# EAGLE design drive-sys-board (EAGLE 7.6.0)
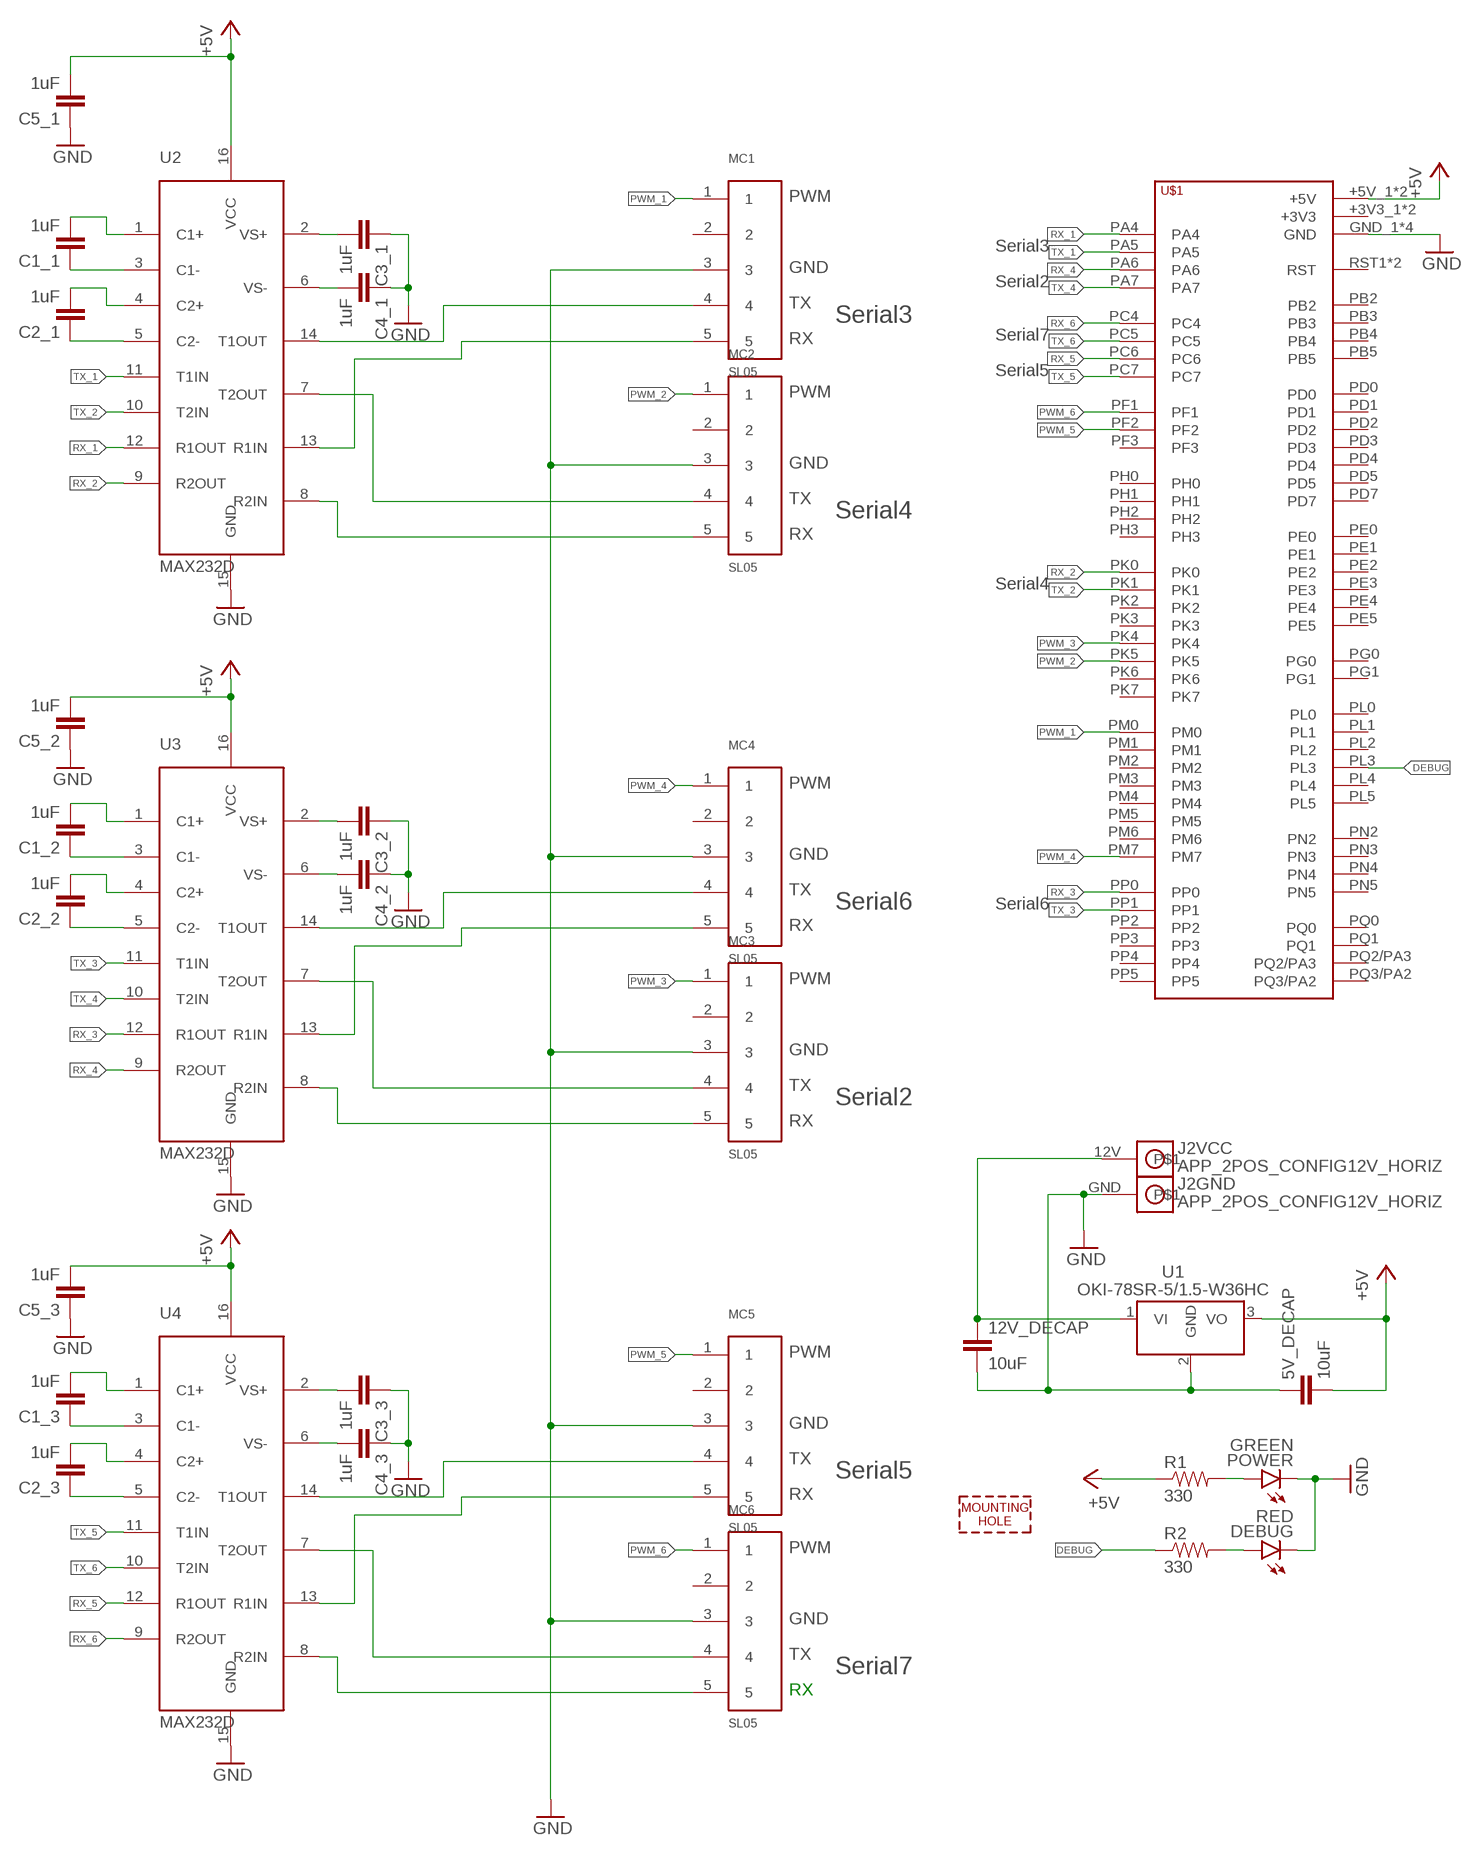
[diagram p0: schematic, sheet 1]

## Parts
5V_DECAP  10uF  CAP0805  [0805]
12V_DECAP  10uF  CAP0805  [0805]
C1_1  1uF  CAP0805  [0805]
C1_2  1uF  CAP0805  [0805]
C1_3  1uF  CAP0805  [0805]
C2_1  1uF  CAP0805  [0805]
C2_2  1uF  CAP0805  [0805]
C2_3  1uF  CAP0805  [0805]
C3_1  1uF  CAP0805  [0805]
C3_2  1uF  CAP0805  [0805]
C3_3  1uF  CAP0805  [0805]
C4_1  1uF  CAP0805  [0805]
C4_2  1uF  CAP0805  [0805]
C4_3  1uF  CAP0805  [0805]
C5_1  1uF  CAP0805  [0805]
C5_2  1uF  CAP0805  [0805]
C5_3  1uF  CAP0805  [0805]
DEBUG  RED  LED-RED1206  [LED-1206]
H2  MOUNTING_HOLE#6  [#6_SCREW]
J2  APP_2POS_CONFIG12V_HORIZ  [APP45_12V_HORIZ_CONFIG]
MC1  SL05  [MOLEX_SL_05_TH]
MC2  SL05  [MOLEX_SL_05_TH]
MC3  SL05  [MOLEX_SL_05_TH]
MC4  SL05  [MOLEX_SL_05_TH]
MC5  SL05  [MOLEX_SL_05_TH]
MC6  SL05  [MOLEX_SL_05_TH]
POWER  GREEN  LED-GREEN1206  [LED-1206]
R1  330  0.22OHM-1/4W-1%(0805)  [0805]
R2  330  0.22OHM-1/4W-1%(0805)  [0805]
U1  OKI-78SR-5/1.5-W36HC  [OKI-78SR_HORIZ]
U2  MAX232D  [SOIC16]
U3  MAX232D  [SOIC16]
U4  MAX232D  [SOIC16]
U$1  TIVA-1294  [TIVA-C-CONNECTED]

## Nets
+5V: 5V_DECAP.2 C5_1.2 C5_2.2 C5_3.2 R1.1 U1.3(VO) U2.16(VCC) U3.16(VCC) U4.16(VCC) U$1.+5V_1(+5V) U$1.+5V_2(+5V)
DEBUG: R2.1 U$1.PL3
GND: 5V_DECAP.1 12V_DECAP.2 C3_1.1 C3_2.1 C3_3.1 C4_1.1 C4_2.1 C4_3.1 C5_1.1 C5_2.1 C5_3.1 DEBUG.C J2.GND MC1.3 MC2.3 MC3.3 MC4.3 MC5.3 MC6.3 POWER.C U1.2(GND) U2.15(GND) U3.15(GND) U4.15(GND) U$1.GND_1(GND) U$1.GND_2(GND) U$1.GND_3(GND) U$1.GND_4(GND)
N$3: C1_1.2 U2.1(C1+)
N$4: C1_1.1 U2.3(C1-)
N$5: 12V_DECAP.1 J2.12V U1.1(VI)
N$6: C2_1.2 U2.4(C2+)
N$7: C2_1.1 U2.5(C2-)
N$8: C3_1.2 U2.2(VS+)
N$9: C4_1.2 U2.6(VS-)
N$10: DEBUG.A R2.2
N$11: C1_2.2 U3.1(C1+)
N$12: C1_2.1 U3.3(C1-)
N$13: C2_2.2 U3.4(C2+)
N$14: C3_2.2 U3.2(VS+)
N$15: C4_2.2 U3.6(VS-)
N$16: C2_2.1 U3.5(C2-)
N$17: POWER.A R1.2
N$18: C1_3.2 U4.1(C1+)
N$19: C1_3.1 U4.3(C1-)
N$20: C2_3.2 U4.4(C2+)
N$21: C3_3.2 U4.2(VS+)
N$22: C4_3.2 U4.6(VS-)
N$23: C2_3.1 U4.5(C2-)
N$26: MC5.4 U4.14(T1OUT)
N$27: MC6.5 U4.8(R2IN)
N$28: MC6.4 U4.7(T2OUT)
N$29: MC5.5 U4.13(R1IN)
N$30: MC3.5 U3.8(R2IN)
N$31: MC3.4 U3.7(T2OUT)
N$32: MC4.4 U3.14(T1OUT)
N$33: MC4.5 U3.13(R1IN)
N$34: MC2.5 U2.8(R2IN)
N$35: MC2.4 U2.7(T2OUT)
N$36: MC1.4 U2.14(T1OUT)
N$37: MC1.5 U2.13(R1IN)
PWM_1: MC1.1 U$1.PM0
PWM_2: MC2.1 U$1.PK5
PWM_3: MC3.1 U$1.PK4
PWM_4: MC4.1 U$1.PM7
PWM_5: MC5.1 U$1.PF2
PWM_6: MC6.1 U$1.PF1
RX_1: U2.12(R1OUT) U$1.PA4
RX_2: U2.9(R2OUT) U$1.PK0
RX_3: U3.12(R1OUT) U$1.PP0
RX_4: U3.9(R2OUT) U$1.PA6
RX_5: U4.12(R1OUT) U$1.PC6
RX_6: U4.9(R2OUT) U$1.PC4
TX_1: U2.11(T1IN) U$1.PA5
TX_2: U2.10(T2IN) U$1.PK1
TX_3: U3.11(T1IN) U$1.PP1
TX_4: U3.10(T2IN) U$1.PA7
TX_5: U4.11(T1IN) U$1.PC7
TX_6: U4.10(T2IN) U$1.PC5
Unconnected: MC1.2 MC2.2 MC3.2 MC4.2 MC5.2 MC6.2 U$1.+3V3_1(+3V3) U$1.+3V3_2(+3V3) U$1.PB2 U$1.PB3 U$1.PB4 U$1.PB5 U$1.PD0 U$1.PD1 U$1.PD2 U$1.PD3 U$1.PD4 U$1.PD5 U$1.PD7 U$1.PE0 U$1.PE1 U$1.PE2 U$1.PE3 U$1.PE4 U$1.PE5 U$1.PF3 U$1.PG0 U$1.PG1 U$1.PH0 U$1.PH1 U$1.PH2 U$1.PH3 U$1.PK2 U$1.PK3 U$1.PK6 U$1.PK7 U$1.PL0 U$1.PL1 U$1.PL2 U$1.PL4 U$1.PL5 U$1.PM1 U$1.PM2 U$1.PM3 U$1.PM4 U$1.PM5 U$1.PM6 U$1.PN2 U$1.PN3 U$1.PN4 U$1.PN5 U$1.PP2 U$1.PP3 U$1.PP4 U$1.PP5 U$1.PQ0 U$1.PQ1 U$1.PQ2/PA3 U$1.PQ3/PA2 U$1.RST1(RST) U$1.RST_2(RST)

## Notes on the sheet
- PWM
- Serial3
- GND
- Serial2
- TX
- Serial3
- RX | Serial7
- Serial5
- PWM
- GND
- TX
- Serial4
- RX
- Serial4
- PWM
- GND
- TX
- Serial6 | Serial6
- RX
- PWM
- GND
- TX
- Serial2
- RX
- PWM
- GND
- TX
- Serial5
- RX
- PWM
- GND
- TX
- Serial7
- RX

## Library data of the parts
5V_DECAP 12V_DECAP C1_1-C1_3 C2_1-C2_3 C3_1-C3_3 C4_1-C4_3 C5_1-C5_3 = SparkFun-Capacitors:CAP: Capacitor Standard 0603 ceramic capacitor, and 0.1" leaded capacitor.
DEBUG = SparkFun-LED:LED-RED: Assorted Red LEDs LilyPad 1206- DIO-09912 1206- DIO-00809 0603- DIO-00819 "SMART" means more efficient and expensive; PROD_ID: DIO-09912
H2 = MRDT-Hardware:MOUNTING_HOLE: Mounting hole for M6 bolt. Standard use mounting hole for: Tiva C Connected - M6 Anderson Powerpole Mounting Wing - M8 Most frame-mounted PCB's - M8
J2 = MRDT-Connectors:APP_2POS_CONFIG; COLOR1: YELLOW; COLOR2: BLACK
MC1-MC6 = MRDT-Connectors:SL05
POWER = SparkFun-LED:LED-GREEN: Various green LEDs Green LEDs used in SFE Production 0603- DIO-00821 LARGE- DIO-00862 LILYPAD- DIO-09910; PROD_ID: DIO-00862
R1 R2 = SparkFun-Resistors:0.22OHM-1/4W-1%(0805): RES-09883; PROD_ID: RES-09883; VALUE: 0.22
U1 = MRDT-ICs:OKI-78SR-*/1.5-W36?C: 4.95W DC/DC Converter Manufacturer: Murata; VOUT: +5v
U2-U4 = MRDT-ICs:MAX*232; OPERATING_VOLTAGE: 5V
U$1 = MRDT-Microcontrollers:TIVA-1294: TIVA C CONNECTED LAUNCHPAD

## Board
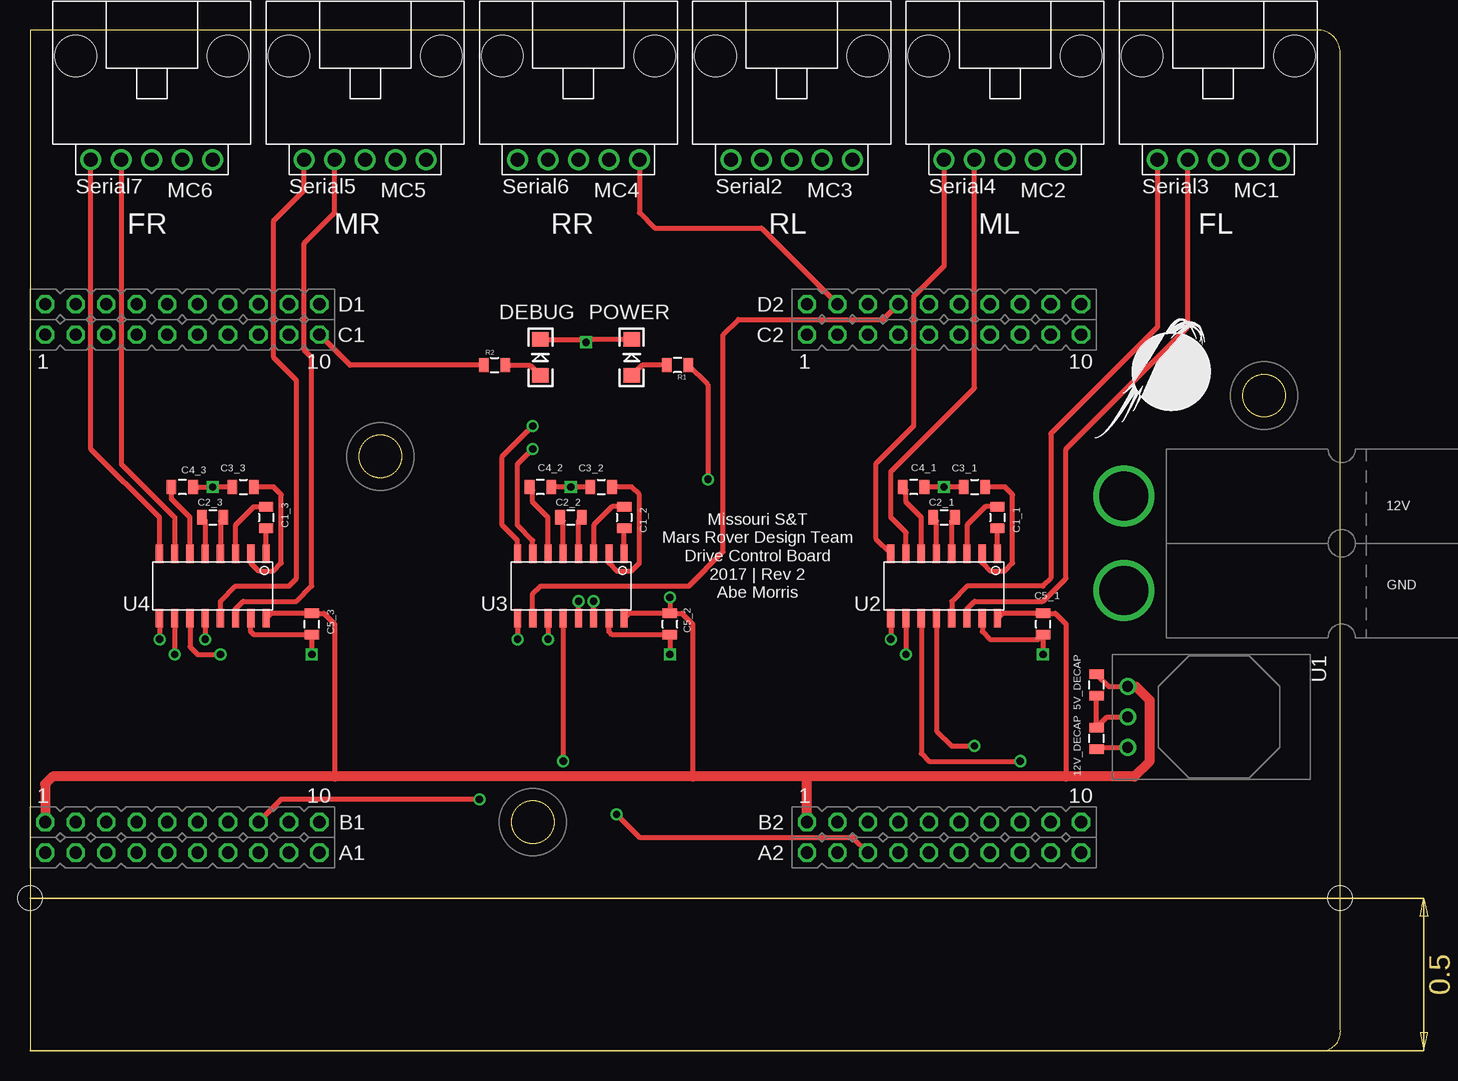
[diagram p1: board, top side]
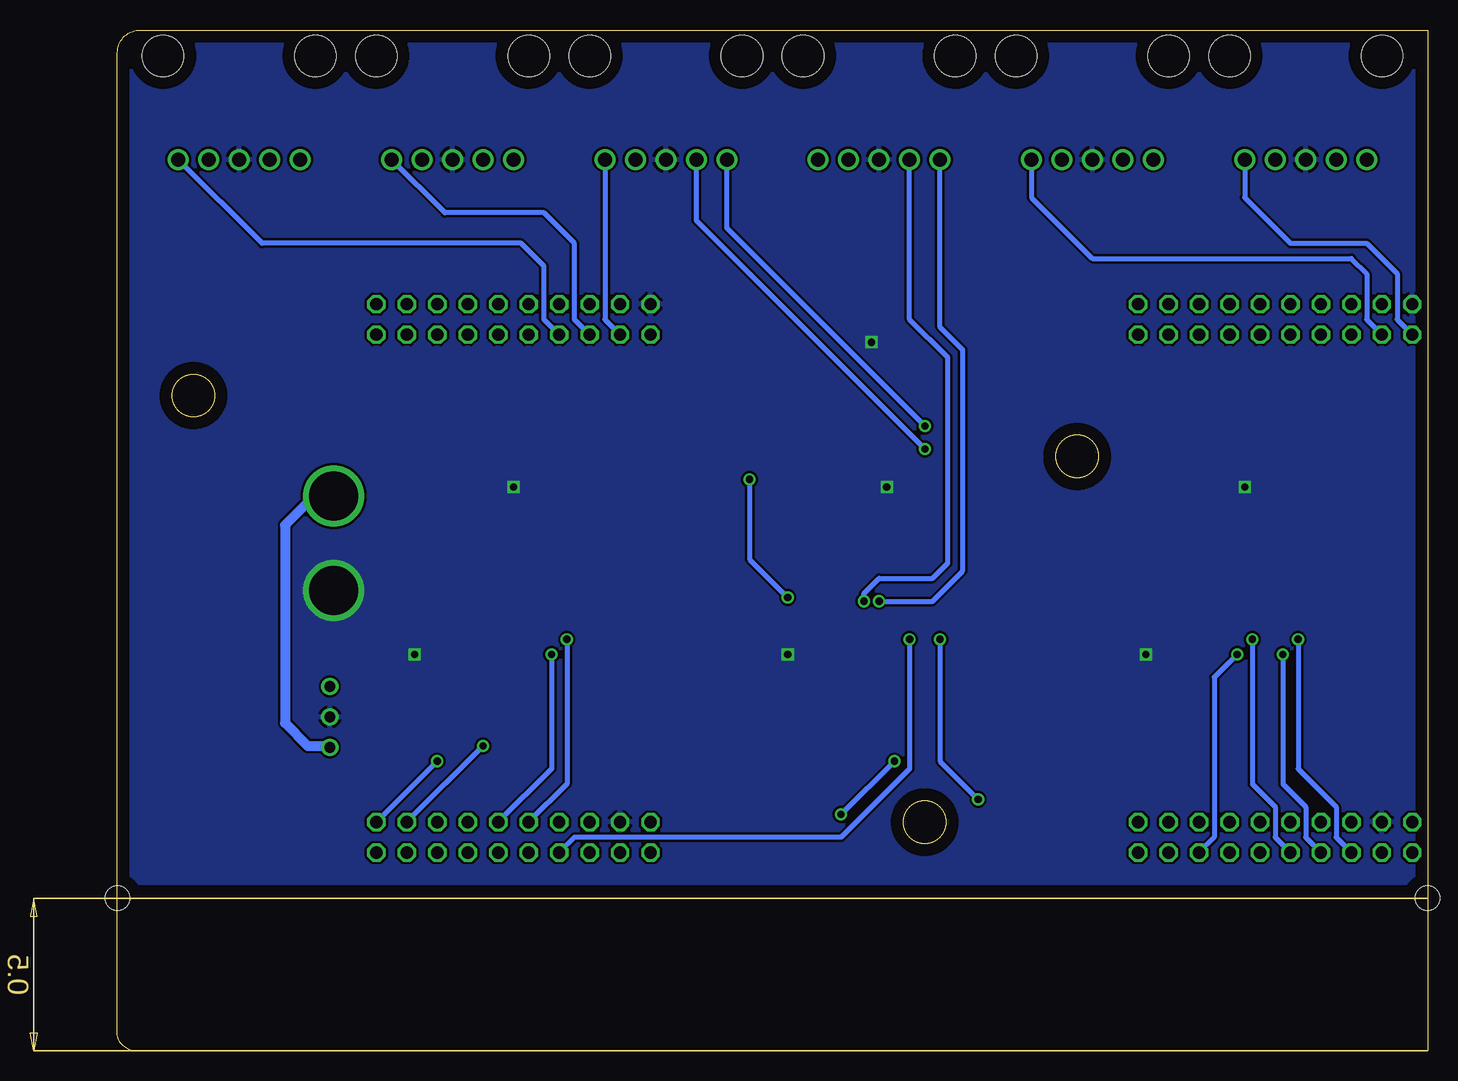
[diagram p2: board, bottom side, seen from below]

Size 109.25 x 85.09 mm. Coordinates in mm from the lower left corner, seen from the top.
Outline: 109.22,1.9 109.22,83.19 arc90 107.31,85.09 0,85.09 0,0 107.95,0 arc90 109.22,1.9
Copper layers (1*16): Top 0.035mm / dielectric 1.5mm / Bottom 0.035mm
Design rules "default *": minimum track width 10mil, minimum drill 15mil, track to track 8mil, track to pad 8mil, pad to pad 8mil, via to via 8mil, smd to smd 8mil, copper to edge 40mil, drill to drill 8mil, minimum pad ring 10mil, minimum via ring 8mil, stop-mask expansion 4mil, vias tented up to drill 0mil, thermal gap 10mil
Holes 2.03 mm at 0,12.7 109.22,12.7

### Footprints (pad centres in the part's own frame; a part is rotated, then mirrored left to right if it is on the bottom)
0805 = smd 0.8 x 1.2: 1 -0.9,0; 2 0.9,0
LED-1206 = smd 1.2 x 1.4: A -1.5,0; C 1.5,0
APP45_12V_HORIZ_CONFIG = drill 4.064: 12V 28.194,3.937; GND 28.194,11.811
MOLEX_SL_05_TH = drill 1.168: 1 5.08,0; 2 2.54,0; 3 0,0; 4 -2.54,0; 5 -5.08,0 | hole 3.454: -6.35,8.636; 6.35,8.636
OKI-78SR_HORIZ = drill 0.9 pad 1.422: 1 0,0; 2 -2.54,0; 3 -5.08,0
SOIC16 = smd 0.6 x 1.55: 1 -4.445,-2.7; 2 -3.175,-2.7; 3 -1.905,-2.7; 4 -0.635,-2.7; 5 0.635,-2.7; 6 1.905,-2.7; 7 3.175,-2.7; 8 4.445,-2.7; 9 4.445,2.7; 10 3.175,2.7; 11 1.905,2.7; 12 0.635,2.7; 13 -0.635,2.7; 14 -1.905,2.7; 15 -3.175,2.7; 16 -4.445,2.7
TIVA-C-CONNECTED = drill 1.016 octagon: +3V3_1 59.69,54.61; +3V3_2 123.19,54.61; +5V_1 59.69,52.07; +5V_2 123.19,52.07; GND_1 57.15,52.07; GND_2 59.69,8.89; GND_3 120.65,52.07; GND_4 123.19,8.89; PA4 39.37,52.07; PA5 36.83,52.07; PA6 105.41,52.07; PA7 52.07,8.89; PB2 102.87,54.61; PB3 100.33,54.61; PB4 54.61,52.07; PB5 52.07,52.07; PC4 118.11,54.61; PC5 115.57,54.61; PC6 113.03,54.61; PC7 105.41,54.61; PD0 107.95,8.89; PD1 110.49,8.89; PD2 57.15,54.61; PD3 107.95,54.61; PD4 49.53,54.61; PD5 46.99,54.61; PD7 107.95,52.07; PE0 118.11,52.07; PE1 115.57,52.07; PE2 113.03,52.07; PE3 110.49,52.07; PE4 120.65,54.61; PE5 110.49,54.61; PF1 123.19,11.43; PF2 120.65,11.43; PF3 118.11,11.43; PG0 115.57,11.43; PG1 59.69,11.43; PH0 44.45,11.43; PH1 41.91,11.43; PH2 118.11,8.89; PH3 115.57,8.89; PK0 49.53,52.07; PK1 46.99,52.07; PK2 44.45,52.07; PK3 41.91,52.07; PK4 57.15,11.43; PK5 54.61,11.43; PK6 39.37,11.43; PK7 36.83,11.43; PL0 107.95,11.43; PL1 105.41,11.43; PL2 102.87,11.43; PL3 100.33,11.43; PL4 113.03,11.43; PL5 110.49,11.43; PM0 52.07,11.43; PM1 49.53,11.43; PM2 46.99,11.43; PM3 120.65,8.89; PM4 102.87,52.07; PM5 100.33,52.07; PM6 36.83,8.89; PM7 57.15,8.89; PN2 105.41,8.89; PN3 102.87,8.89; PN4 36.83,54.61; PN5 39.37,54.61; PP0 54.61,54.61; PP1 52.07,54.61; PP2 100.33,8.89; PP3 41.91,8.89; PP4 41.91,54.61; PP5 54.61,8.89; PQ0 44.45,54.61; PQ1 39.37,8.89; PQ2/PA3 46.99,8.89; PQ3/PA2 44.45,8.89; RST1 49.53,8.89; RST_2 113.03,8.89

### Placement (x,y rotation side)
5V_DECAP  88.9,30.48 90 top
12V_DECAP  88.9,26.04 90 top
C1_1  80.64,44.45 270 top
C1_2  49.53,44.45 270 top
C1_3  19.69,44.45 270 top
C2_1  76.2,44.45 0 top
C2_2  45.08,44.45 0 top
C2_3  15.24,44.45 0 top
C3_1  78.74,46.99 0 top
C3_2  47.62,46.99 0 top
C3_3  17.78,46.99 0 top
C4_1  73.66,46.99 180 top
C4_2  42.54,46.99 180 top
C4_3  12.7,46.99 180 top
C5_1  84.45,35.56 90 top
C5_2  53.34,35.56 90 top
C5_3  23.49,35.56 90 top
DEBUG  42.54,57.79 90 top
H1  MOUNTING_HOLE#6  [#6_SCREW]  29.21,49.53 180 top
H2  41.91,19.05 180 top
H3  MOUNTING_HOLE#6  [#6_SCREW]  102.87,54.61 180 top
J2  119.38,50.16 180 top
MC1  99.06,74.3 0 top
MC2  81.28,74.3 0 top
MC3  63.5,74.3 0 top
MC4  45.72,74.3 0 top
MC5  27.94,74.3 0 top
MC6  10.16,74.3 0 top
POWER  50.16,57.79 90 top
R1  53.97,57.15 180 top
R2  38.73,57.15 0 top
U1  91.5,25.27 270 top
U2  76.2,38.73 180 top
U3  45.08,38.73 180 top
U4  15.24,38.73 180 top
U$1  124.46,71.12 180 top
U$2  [MRDT_LOGO]  98.44,61.89 180 top

### Tracks (layer width: path | path; a pad name or v marks a point on that pad's centre or on a via)
+5V  (via drill 0.6)
  Top 0.406: 86.36,22.86 86.36,35.56 85.46,36.46 C5_1.2 81.07,36.46 U2.16 | C5_2.2 54.34,36.46 55.24,35.56 55.24,22.86 | C5_2.2 49.95,36.46 U3.16 | 25.4,22.86 25.4,35.56 24.5,36.46 C5_3.2 20.11,36.46 U4.16 | v56.51,47.62 56.51,55.51 R1.1 | v53.34,37.78 C5_2.2 | 5V_DECAP.2 89.93,30.35 U1.3
  Top 0.813: 64.77,22.86 86.36,22.86 92.07,22.86 93.34,24.13 93.34,29.21 92.2,30.35 U1.3 | 64.77,22.86 55.24,22.86 25.4,22.86 1.91,22.86 1.27,22.23 U$1.+5V_2 | U$1.+5V_1 64.77,22.86
  Bottom 0.406: v56.51,47.62 56.51,40.96 v53.34,37.78
DEBUG
  Top 0.406: R2.1 26.67,57.15 U$1.PL3
GND  (via drill 0.6)
  Top 0.406: 5V_DECAP.1 12V_DECAP.2 89.78,27.81 U1.2 | U2.15 79.38,34.92 80.01,34.29 84.08,34.29 C5_1.1 v84.45,33.02 | v53.34,33.02 C5_2.1 48.52,34.66 48.26,34.92 U3.15 | v23.49,33.02 C5_3.1 18.68,34.66 18.41,34.92 U4.15 | C3_1.1 v76.2,46.99 C4_1.1 | C3_2.1 v45.08,46.99 C4_2.1 | C3_3.1 v15.24,46.99 C4_3.1 | POWER.C 46.58,59.29 v46.35,59.05 46.12,59.29 DEBUG.C
  pour Bottom: 109.9,-0.18 109.98,85.8 -0.27,85.64 -0.35,-0.4
N$3
  Top 0.406: U2.1 C1_1.2
N$4
  Top 0.406: C1_1.1 79.64,45.35 78.1,43.82 U2.3
N$5
  Top 0.406: 12V_DECAP.1 89.04,25.27 U1.1
  Bottom 0.813: U1.1 91.63,25.4 93.34,25.4 95.25,27.3 95.25,43.82 92.71,46.36 92.58,46.23 J2.12V
N$6
  Top 0.406: U2.4 76.83,44.19 C2_1.2
N$7
  Top 0.406: U2.5 75.56,44.19 C2_1.1
N$8
  Top 0.406: U2.2 79.38,40.64 80.01,40.01 81.28,40.01 81.91,40.64 81.91,46.36 81.28,46.99 C3_1.2
N$9
  Top 0.406: U2.6 74.29,44.45 73.02,45.72 73.02,46.73 C4_1.2
N$10
  Top 0.406: R2.2 41.68,57.15 DEBUG.A
N$11
  Top 0.406: U3.1 C1_2.2
N$12
  Top 0.406: C1_2.1 48.52,45.35 46.99,43.82 U3.3
N$13
  Top 0.406: U3.4 45.72,44.19 C2_2.2
N$14
  Top 0.406: U3.2 48.26,40.64 48.89,40.01 50.16,40.01 50.8,40.64 50.8,46.36 50.16,46.99 C3_2.2
N$15
  Top 0.406: U3.6 43.18,44.45 41.91,45.72 41.91,46.73 C4_2.2
N$16
  Top 0.406: U3.5 44.45,44.19 C2_2.1
N$17
  Top 0.406: R1.2 51.03,57.15 POWER.A
N$18
  Top 0.406: U4.1 C1_3.2
N$19
  Top 0.406: U4.3 17.14,43.82 18.68,45.35 C1_3.1
N$20
  Top 0.406: C2_3.2 15.88,44.19 U4.4
N$21
  Top 0.406: U4.2 18.41,40.64 19.05,40.01 20.32,40.01 20.95,40.64 20.95,46.36 20.32,46.99 C3_3.2
N$22
  Top 0.406: U4.6 13.33,44.45 11.8,45.98 C4_3.2
N$23
  Top 0.406: C2_3.1 14.6,44.19 U4.5
N$26
  Top 0.406: U4.14 17.14,36.83 17.78,37.47 22.22,37.47 23.49,38.73 23.49,57.79 22.86,58.42 22.86,67.31 25.4,69.85 MC5.4
N$27
  Top 0.406: U4.8 10.8,44.45 5.08,50.16 MC6.5
N$28
  Top 0.406: MC6.4 7.62,48.9 12.06,44.45 U4.7
N$29
  Top 0.406: U4.13 15.88,37.47 17.14,38.73 21.59,38.73 22.22,39.37 22.22,55.88 20.32,57.79 20.32,69.22 22.86,71.75 MC5.5
N$30  (via drill 0.6)
  Top 0.406: U3.8 40.64,42.55 39.37,43.82 39.37,49.53 v41.91,52.07
  Bottom 0.406: v41.91,52.07 58.42,68.58 MC3.5
N$31  (via drill 0.6)
  Top 0.406: U3.7 41.91,42.55 40.64,43.82 40.64,48.9 v41.91,50.16
  Bottom 0.406: v41.91,50.16 60.96,69.22 MC3.4
N$32  (via drill 0.6)
  Top 0.406: U3.14 v46.99,37.47
  Bottom 0.406: v46.99,37.47 46.99,38.1 45.72,39.37 41.27,39.37 40,40.64 40,57.79 43.18,60.96 MC4.4
N$33  (via drill 0.6)
  Top 0.406: U3.13 v45.72,37.47
  Bottom 0.406: v45.72,37.47 41.27,37.47 38.73,40.01 38.73,58.42 40.64,60.33 MC4.5
N$34
  Top 0.406: MC2.5 76.2,65.41 73.66,62.87 73.66,52.07 70.48,48.9 70.48,42.7 U2.8
N$35
  Top 0.406: U2.7 73.02,43.18 71.75,44.45 71.75,48.26 78.74,55.25 MC2.4
N$36
  Top 0.406: U2.14 78.1,36.83 78.74,37.47 84.45,37.47 86.36,39.37 86.36,50.16 96.52,60.33 MC1.4
N$37
  Top 0.406: MC1.5 93.98,60.33 85.09,51.44 85.09,39.37 84.45,38.73 78.1,38.73 76.83,37.47 U2.13
PWM_1
  Bottom 0.406: U$1.PM0 73.66,60.96 73.66,65.41 75.56,67.31 97.16,67.31 MC1.1
PWM_2
  Bottom 0.406: U$1.PK5 71.12,60.96 71.12,67.31 73.66,69.85 81.91,69.85 MC2.1
PWM_3
  Bottom 0.406: MC3.1 68.58,60.96 U$1.PK4
PWM_4
  Top 0.406: MC4.1 50.8,69.85 52.07,68.58 60.96,68.58 U$1.PM7
PWM_5
  Bottom 0.406: MC5.1 33.02,71.12 27.94,66.04 6.35,66.04 5.08,64.77 5.08,60.96 U$1.PF2
PWM_6
  Bottom 0.406: MC6.1 15.24,71.12 11.43,67.31 5.08,67.31 2.54,64.77 2.54,60.96 U$1.PF1
RX_1  (via drill 0.6)
  Top 0.406: U2.12 75.56,26.67 76.83,25.4 v78.74,25.4
  Bottom 0.406: v78.74,25.4 U$1.PA4
RX_2  (via drill 0.6)
  Top 0.406: U2.9 v71.75,34.29
  Bottom 0.406: v71.75,34.29 71.75,22.23 U$1.PK0
RX_3  (via drill 0.6)
  Top 0.406: U3.12 v44.45,24.13 | v48.89,19.69 50.8,17.78 68.58,17.78 U$1.PP0
  Bottom 0.406: v44.45,24.13 v48.89,19.69
RX_4  (via drill 0.6)
  Top 0.406: U3.9 v40.64,34.29 | v37.46,20.95 20.95,20.95 U$1.PA6
  Bottom 0.406: v40.64,34.29 40.64,24.13 v37.46,20.95
RX_5  (via drill 0.6)
  Top 0.406: U4.12 v14.6,34.29
  Bottom 0.406: v14.6,34.29 14.6,22.23 12.7,20.32 12.7,17.78 U$1.PC6
RX_6  (via drill 0.6)
  Top 0.406: U4.9 v10.8,34.29
  Bottom 0.406: v10.8,34.29 10.8,23.49 7.62,20.32 7.62,17.78 U$1.PC4
TX_1  (via drill 0.6)
  Top 0.406: U2.11 74.29,24.77 74.93,24.13 v82.55,24.13
  Bottom 0.406: v82.55,24.13 U$1.PA5
TX_2  (via drill 0.6)
  Top 0.406: U2.10 v73.02,33.02
  Bottom 0.406: v73.02,33.02 73.02,23.49 U$1.PK1
TX_3  (via drill 0.6)
  Top 0.406: U3.11 v43.18,34.29
  Bottom 0.406: v43.18,34.29 43.18,23.49 48.89,17.78 71.12,17.78 U$1.PP1
TX_4
  Top 0.406: U3.10 41.91,38.1 42.54,38.73 54.93,38.73 57.78,41.59 57.78,59.69 59.05,60.96 71.12,60.96 U$1.PA7
TX_5  (via drill 0.6)
  Top 0.406: U4.11 13.33,33.66 13.97,33.02 v15.88,33.02
  Bottom 0.406: v15.88,33.02 17.78,31.12 17.78,17.78 U$1.PC7
TX_6  (via drill 0.6)
  Top 0.406: U4.10 v12.06,33.02
  Bottom 0.406: v12.06,33.02 12.06,22.23 10.16,20.32 10.16,17.78 U$1.PC5

### Text on the board
tPlace: Missouri S&T / Mars Rover Design Team / Drive Control Board / 2017 | Rev 2 / Abe Morris
tNames: Serial7 | Serial5 | Serial6 | Serial2 | Serial4 | Serial3 | FR | MR | RR | RL | ML | FL